# EAGLE schematic CarreraBahn (EAGLE 6.4)
AUTHOR: Florian Weber 44907

## Sheet 1 of 4
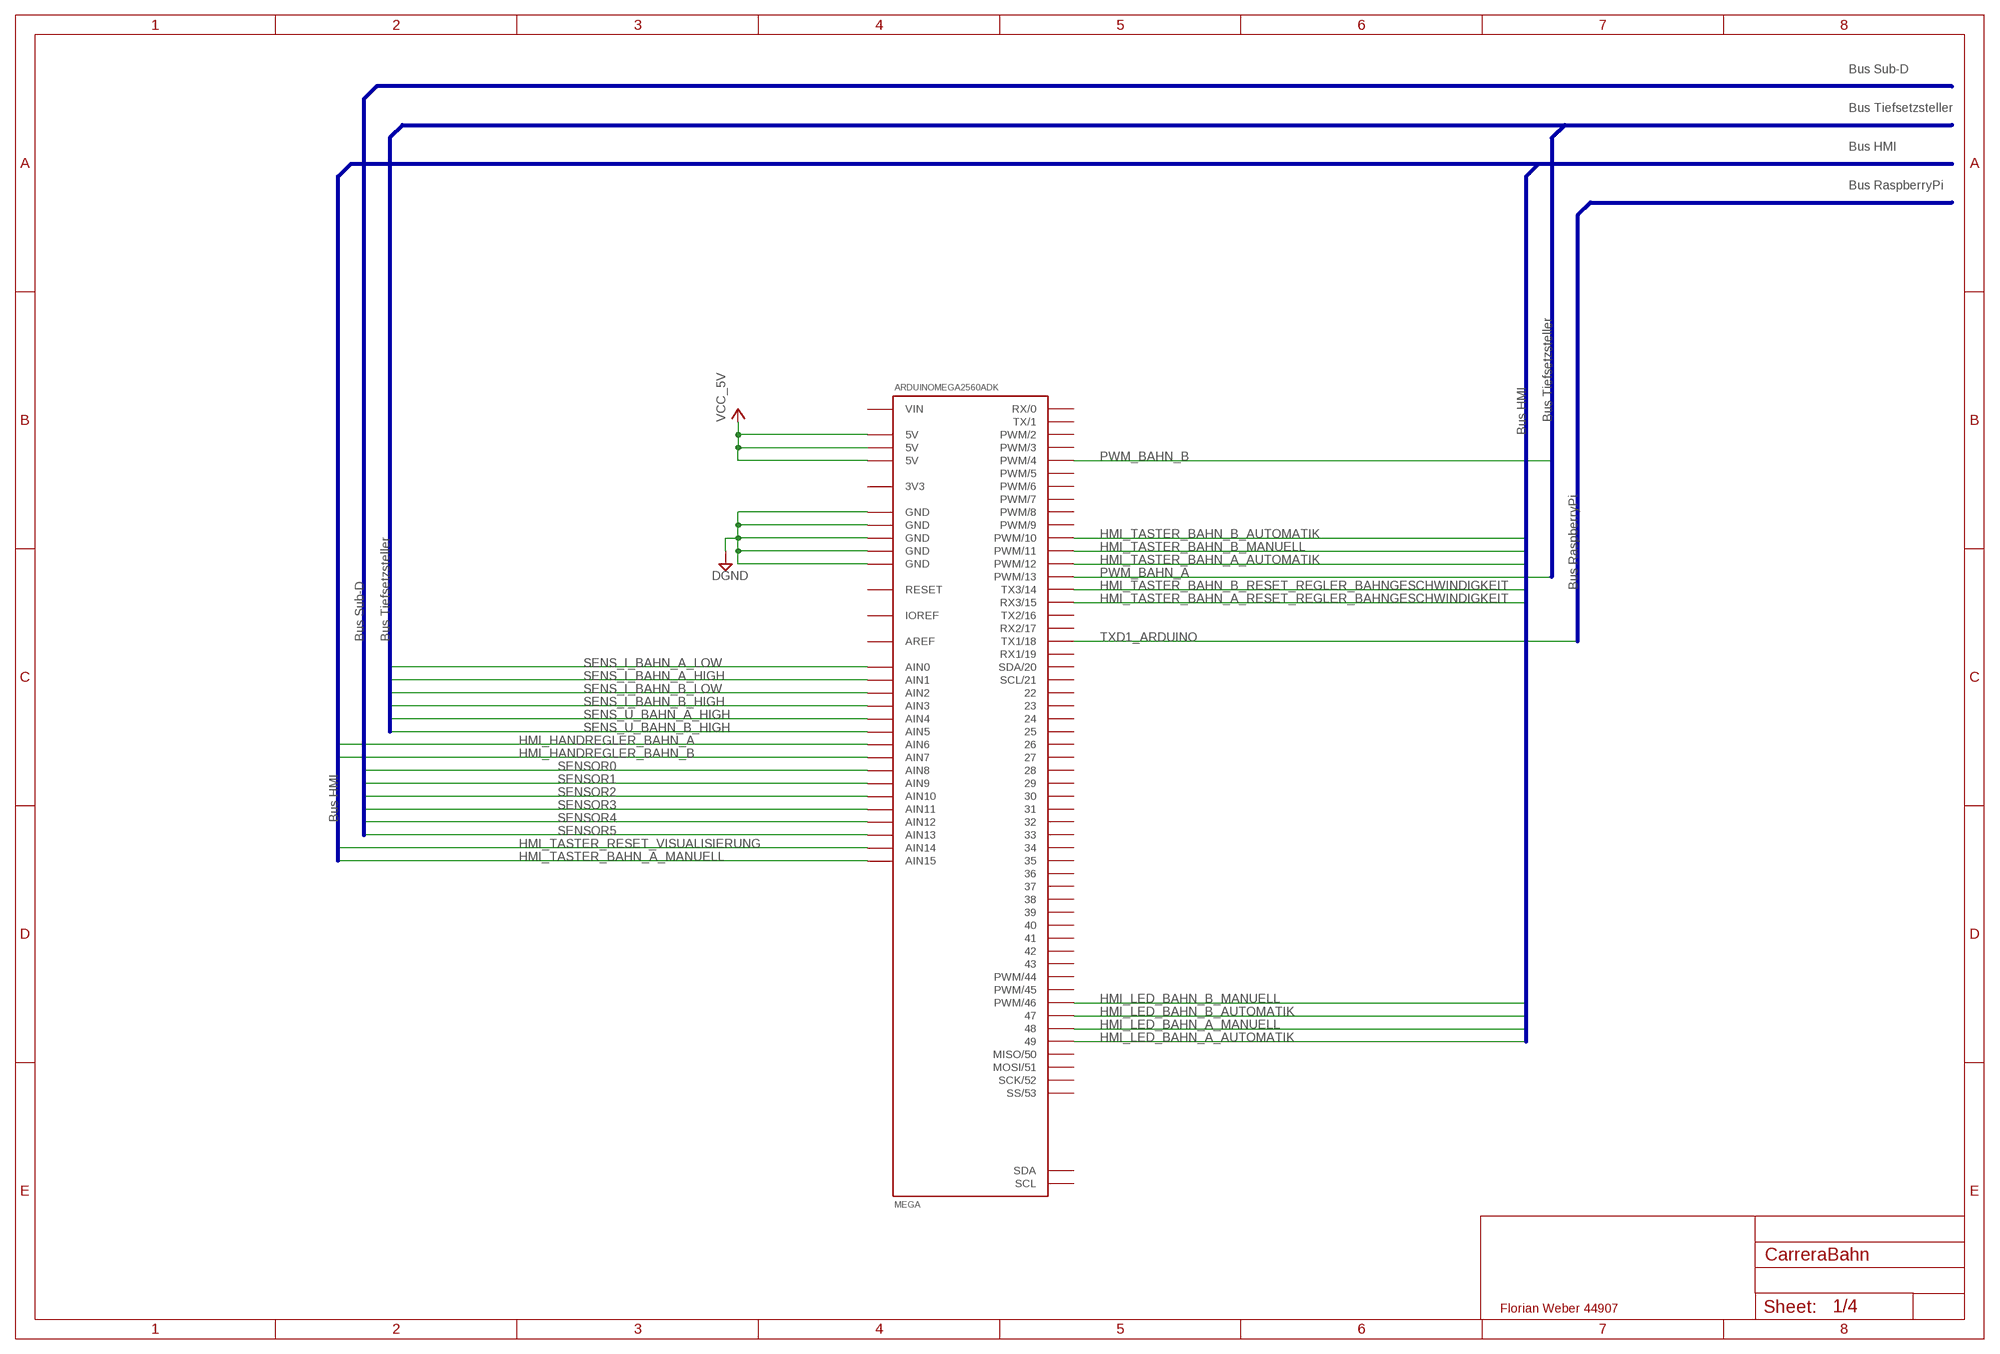
[diagram p0: schematic, sheet 1]

### Parts
ARDUINOMEGA2560ADK  MEGA  [MEGA]

### Nets
DGND: ARDUINOMEGA2560ADK.GND1(GND) ARDUINOMEGA2560ADK.GND2(GND) ARDUINOMEGA2560ADK.GND3(GND) ARDUINOMEGA2560ADK.GND4(GND) ARDUINOMEGA2560ADK.GND5(GND) ; also sheet 2,3,4
HMI_HANDREGLER_BAHN_A: ARDUINOMEGA2560ADK.AIN6 ; also sheet 3
HMI_HANDREGLER_BAHN_B: ARDUINOMEGA2560ADK.AIN7 ; also sheet 3
HMI_LED_BAHN_A_AUTOMATIK: ARDUINOMEGA2560ADK.49 ; also sheet 3
HMI_LED_BAHN_A_MANUELL: ARDUINOMEGA2560ADK.48 ; also sheet 3
HMI_LED_BAHN_B_AUTOMATIK: ARDUINOMEGA2560ADK.47 ; also sheet 3
HMI_LED_BAHN_B_MANUELL: ARDUINOMEGA2560ADK.46(PWM/46) ; also sheet 3
HMI_TASTER_BAHN_A_AUTOMATIK: ARDUINOMEGA2560ADK.12(PWM/12) ; also sheet 3
HMI_TASTER_BAHN_A_MANUELL: ARDUINOMEGA2560ADK.AIN15 ; also sheet 3
HMI_TASTER_BAHN_A_RESET_REGLER_BAHNGESCHWINDIGKEIT: ARDUINOMEGA2560ADK.15(RX3/15) ; also sheet 3
HMI_TASTER_BAHN_B_AUTOMATIK: ARDUINOMEGA2560ADK.10(PWM/10) ; also sheet 3
HMI_TASTER_BAHN_B_MANUELL: ARDUINOMEGA2560ADK.11(PWM/11) ; also sheet 3
HMI_TASTER_BAHN_B_RESET_REGLER_BAHNGESCHWINDIGKEIT: ARDUINOMEGA2560ADK.14(TX3/14) ; also sheet 3
HMI_TASTER_RESET_VISUALISIERUNG: ARDUINOMEGA2560ADK.AIN14 ; also sheet 3
PWM_BAHN_A: ARDUINOMEGA2560ADK.13(PWM/13) ; also sheet 4
PWM_BAHN_B: ARDUINOMEGA2560ADK.4(PWM/4) ; also sheet 4
SENS_I_BAHN_A_HIGH: ARDUINOMEGA2560ADK.AIN1 ; also sheet 4
SENS_I_BAHN_A_LOW: ARDUINOMEGA2560ADK.AIN0 ; also sheet 4
SENS_I_BAHN_B_HIGH: ARDUINOMEGA2560ADK.AIN3 ; also sheet 4
SENS_I_BAHN_B_LOW: ARDUINOMEGA2560ADK.AIN2 ; also sheet 4
SENS_U_BAHN_A_HIGH: ARDUINOMEGA2560ADK.AIN4 ; also sheet 4
SENS_U_BAHN_B_HIGH: ARDUINOMEGA2560ADK.AIN5 ; also sheet 4
SENSOR0: ARDUINOMEGA2560ADK.AIN8 ; also sheet 4
SENSOR1: ARDUINOMEGA2560ADK.AIN9 ; also sheet 4
SENSOR2: ARDUINOMEGA2560ADK.AIN10 ; also sheet 4
SENSOR3: ARDUINOMEGA2560ADK.AIN11 ; also sheet 4
SENSOR4: ARDUINOMEGA2560ADK.AIN12 ; also sheet 4
SENSOR5: ARDUINOMEGA2560ADK.AIN13 ; also sheet 4
TXD1_ARDUINO: ARDUINOMEGA2560ADK.18(TX1/18) ; also sheet 2
VCC: ARDUINOMEGA2560ADK.5V1(5V) ARDUINOMEGA2560ADK.5V2(5V) ARDUINOMEGA2560ADK.5V3(5V) ; supply symbol labelled VCC_5V ; also sheet 2,3,4
Unconnected: ARDUINOMEGA2560ADK.0(RX/0) ARDUINOMEGA2560ADK.1(TX/1) ARDUINOMEGA2560ADK.2(PWM/2) ARDUINOMEGA2560ADK.3(PWM/3) ARDUINOMEGA2560ADK.5(PWM/5) ARDUINOMEGA2560ADK.6(PWM/6) ARDUINOMEGA2560ADK.7(PWM/7) ARDUINOMEGA2560ADK.8(PWM/8) ARDUINOMEGA2560ADK.9(PWM/9) ARDUINOMEGA2560ADK.16(TX2/16) ARDUINOMEGA2560ADK.17(RX2/17) ARDUINOMEGA2560ADK.19(RX1/19) ARDUINOMEGA2560ADK.20(SDA/20) ARDUINOMEGA2560ADK.21(SCL/21) ARDUINOMEGA2560ADK.22 ARDUINOMEGA2560ADK.23 ARDUINOMEGA2560ADK.24 ARDUINOMEGA2560ADK.25 ARDUINOMEGA2560ADK.26 ARDUINOMEGA2560ADK.27 ARDUINOMEGA2560ADK.28 ARDUINOMEGA2560ADK.29 ARDUINOMEGA2560ADK.30 ARDUINOMEGA2560ADK.31 ARDUINOMEGA2560ADK.32 ARDUINOMEGA2560ADK.33 ARDUINOMEGA2560ADK.34 ARDUINOMEGA2560ADK.35 ARDUINOMEGA2560ADK.36 ARDUINOMEGA2560ADK.37 ARDUINOMEGA2560ADK.38 ARDUINOMEGA2560ADK.39 ARDUINOMEGA2560ADK.40 ARDUINOMEGA2560ADK.41 ARDUINOMEGA2560ADK.42 ARDUINOMEGA2560ADK.43 ARDUINOMEGA2560ADK.44(PWM/44) ARDUINOMEGA2560ADK.45(PWM/45) ARDUINOMEGA2560ADK.50(MISO/50) ARDUINOMEGA2560ADK.51(MOSI/51) ARDUINOMEGA2560ADK.52(SCK/52) ARDUINOMEGA2560ADK.53(SS/53) ARDUINOMEGA2560ADK.RST(RESET) ARDUINOMEGA2560ADK.SCL ARDUINOMEGA2560ADK.SDA

### Buses
POWER_BAHN_A_PLUS,POWER_BAHN_A_MINUS,POWER_BAHN_B_PLUS,POWER_BAHN_B_MINUS,SENSOR[0..5]
PWM_BAHN_A,SENS_I_BAHN_A_HIGH,SENS_I_BAHN_A_LOW,SENS_U_BAHN_A_HIGH,PWM_BAHN_B,SENS_I_BAHN_B_HIGH,SENS_I_BAHN_B_LOW,SENS_U_BAHN_B_HIGH,POWER_IN_TIEFSETZSTELLER_BAHN_A_PLUS,POWER_IN_TIEFSETZSTELLER_BAHN_A_MINUS,POWER_IN_TIEFSETZSTELLER_BAHN_B_PLUS,POWER_IN_TIEFSETZSTELLER_BAHN_B_MINUS
HMI_TASTER_BAHN_A_AUTOMATIK,HMI_TASTER_BAHN_A_MANUELL,HMI_TASTER_BAHN_A_RESET_REGLER_BAHNGESCHWINDIGKEIT,HMI_LED_BAHN_A_AUTOMATIK,HMI_LED_BAHN_A_MANUELL,HMI_HANDREGLER_BAHN_A,HMI_TASTER_BAHN_B_AUTOMATIK,HMI_TASTER_BAHN_B_MANUELL,HMI_TASTER_BAHN_B_RESET_REGLER_BAHNGESCHWINDIGKEIT,HMI_LED_BAHN_B_AUTOMATIK,HMI_LED_BAHN_B_MANUELL,HMI_HANDREGLER_BAHN_B,HMI_TASTER_RESET_VISUALISIERUNG
TXD1_ARDUINO

### Notes on the sheet
- Bus Sub-D
- Bus Tiefsetzsteller
- Bus HMI
- Bus RaspberryPi
- Bus Tiefsetzsteller
- Bus HMI
- Bus RaspberryPi
- Bus Sub-D | Bus Tiefsetzsteller
- Bus HMI

## Sheet 2 of 4
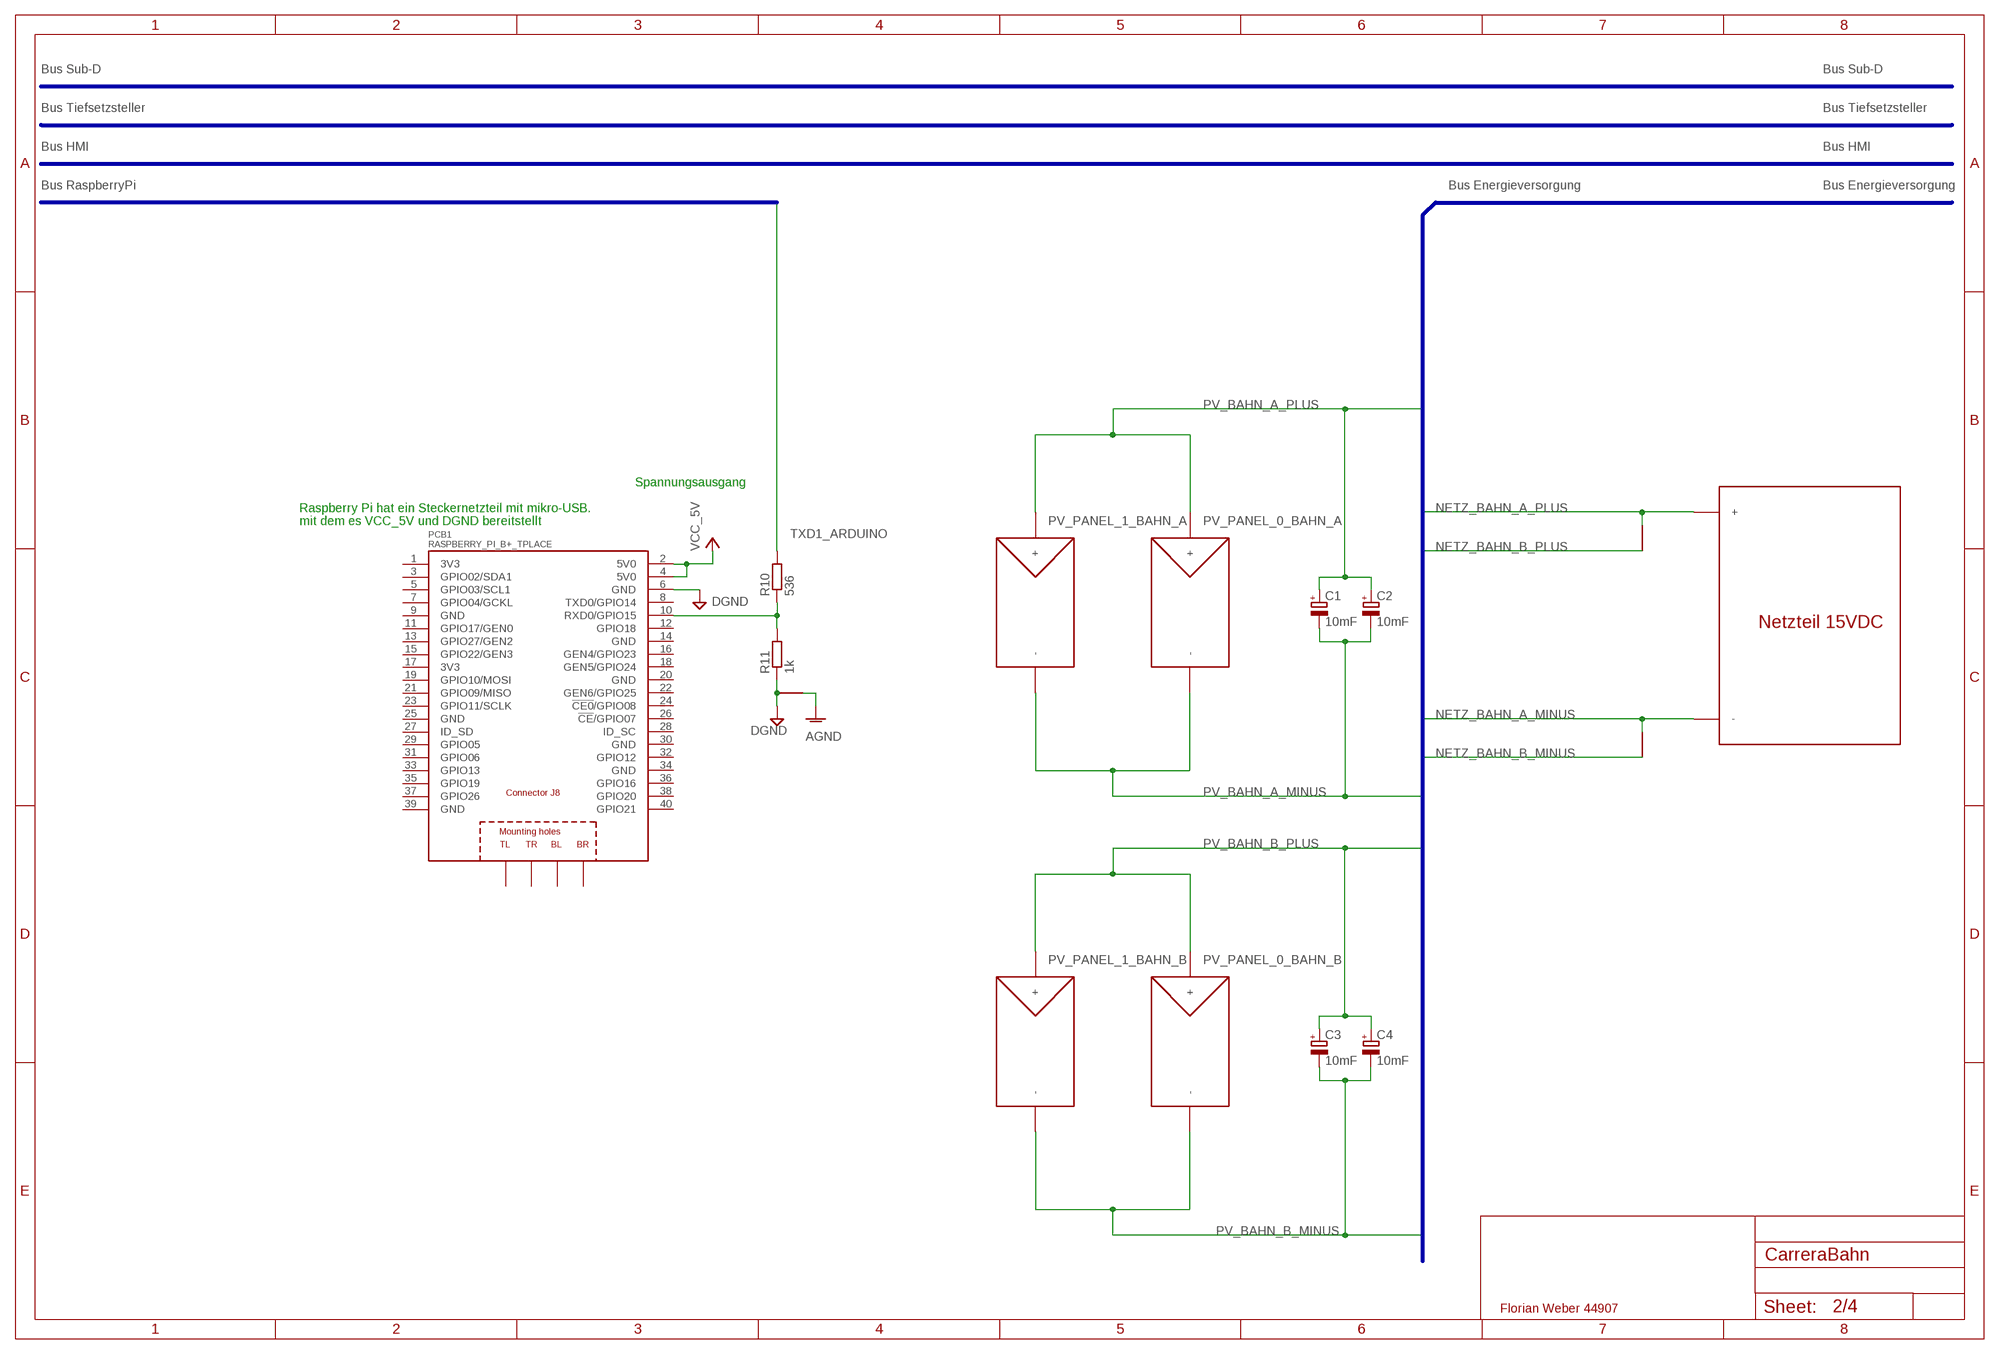
[diagram p1: schematic, sheet 2]

### Parts
C1  10mF  CPOL-EUE10-35  [EB35D]
C2  10mF  CPOL-EUE10-35  [EB35D]
C3  10mF  CPOL-EUE10-35  [EB35D]
C4  10mF  CPOL-EUE10-35  [EB35D]
PCB1  RASPBERRY_PI_B+_TPLACE  [RASPBERRY_PI_BPLUS_TPLACE]
PV_PANEL_0_BAHN_A  PVPANEL  [2PIN]
PV_PANEL_0_BAHN_B  PVPANEL  [2PIN]
PV_PANEL_1_BAHN_A  PVPANEL  [2PIN]
PV_PANEL_1_BAHN_B  PVPANEL  [2PIN]
R10  536  R-EU_0204/5  [0204/5]
R11  1k  R-EU_0204/5  [0204/5]
U$1  NETZTEIL15VDC  [2PIN]
U$3  BRIDGE  [2PIN]
U$4  BRIDGE  [2PIN]
U$5  BRIDGE  [2PIN]

### Nets
AGND: U$5.P0(_) ; also sheet 3,4
DGND: PCB1.6(GND) R11.1 U$5.P1(__) ; also sheet 1,3,4
N$9: PCB1.10(RXD0/GPIO15) R10.1 R11.2
NETZ_BAHN_A_MINUS: U$1.P1(-) U$4.P1(__) ; also sheet 3
NETZ_BAHN_A_PLUS: U$1.P0(+) U$3.P1(__) ; also sheet 3
NETZ_BAHN_B_MINUS: U$4.P0(_) ; also sheet 3
NETZ_BAHN_B_PLUS: U$3.P0(_) ; also sheet 3
PV_BAHN_A_MINUS: C1.- C2.- PV_PANEL_0_BAHN_A.P1(-) PV_PANEL_1_BAHN_A.P1(-) ; also sheet 3
PV_BAHN_A_PLUS: C1.+ C2.+ PV_PANEL_0_BAHN_A.P0(+) PV_PANEL_1_BAHN_A.P0(+) ; also sheet 3
PV_BAHN_B_MINUS: C3.- C4.- PV_PANEL_0_BAHN_B.P1(-) PV_PANEL_1_BAHN_B.P1(-) ; also sheet 3
PV_BAHN_B_PLUS: C3.+ C4.+ PV_PANEL_0_BAHN_B.P0(+) PV_PANEL_1_BAHN_B.P0(+) ; also sheet 3
TXD1_ARDUINO: R10.2 ; also sheet 1
VCC: PCB1.2(5V0) PCB1.4(5V0) ; supply symbol labelled VCC_5V ; also sheet 1,3,4
Unconnected: PCB1.3(GPIO02/SDA1) PCB1.5(GPIO03/SCL1) PCB1.7(GPIO04/GCKL) PCB1.8(TXD0/GPIO14) PCB1.11(GPIO17/GEN0) PCB1.12(GPIO18) PCB1.13(GPIO27/GEN2) PCB1.15(GPIO22/GEN3) PCB1.16(GEN4/GPIO23) PCB1.18(GEN5/GPIO24) PCB1.19(GPIO10/MOSI) PCB1.21(GPIO09/MISO) PCB1.22(GEN6/GPIO25) PCB1.23(GPIO11/SCLK) PCB1.24(!CE0!/GPIO08) PCB1.26(!CE!/GPIO07) PCB1.27(ID_SD) PCB1.28(ID_SC) PCB1.29(GPIO05) PCB1.31(GPIO06) PCB1.32(GPIO12) PCB1.33(GPIO13) PCB1.35(GPIO19) PCB1.36(GPIO16) PCB1.37(GPIO26) PCB1.38(GPIO20) PCB1.40(GPIO21) PCB1.PE_BL(BL) PCB1.PE_BR(BR) PCB1.PE_TL(TL) PCB1.PE_TR(TR)

### Buses
POWER_BAHN_A_PLUS,POWER_BAHN_A_MINUS,POWER_BAHN_B_PLUS,POWER_BAHN_B_MINUS,SENSOR[0..5]
PV_BAHN_A_PLUS,PV_BAHN_A_MINUS,NETZ_BAHN_A_PLUS,NETZ_BAHN_A_MINUS,PV_BAHN_B_PLUS,PV_BAHN_B_MINUS,NETZ_BAHN_B_PLUS,NETZ_BAHN_B_MINUS
HMI_TASTER_BAHN_A_AUTOMATIK,HMI_TASTER_BAHN_A_MANUELL,HMI_TASTER_BAHN_A_RESET_REGLER_BAHNGESCHWINDIGKEIT,HMI_LED_BAHN_A_AUTOMATIK,HMI_LED_BAHN_A_MANUELL,HMI_HANDREGLER_BAHN_A,HMI_TASTER_BAHN_B_AUTOMATIK,HMI_TASTER_BAHN_B_MANUELL,HMI_TASTER_BAHN_B_RESET_REGLER_BAHNGESCHWINDIGKEIT,HMI_LED_BAHN_B_AUTOMATIK,HMI_LED_BAHN_B_MANUELL,HMI_HANDREGLER_BAHN_B,HMI_TASTER_RESET_VISUALISIERUNG
PWM_BAHN_A,SENS_I_BAHN_A_HIGH,SENS_I_BAHN_A_LOW,SENS_U_BAHN_A_HIGH,PWM_BAHN_B,SENS_I_BAHN_B_HIGH,SENS_I_BAHN_B_LOW,SENS_U_BAHN_B_HIGH,POWER_IN_TIEFSETZSTELLER_BAHN_A_PLUS,POWER_IN_TIEFSETZSTELLER_BAHN_A_MINUS,POWER_IN_TIEFSETZSTELLER_BAHN_B_PLUS,POWER_IN_TIEFSETZSTELLER_BAHN_B_MINUS
TXD1_ARDUINO

### Notes on the sheet
- Bus Sub-D | Bus Sub-D
- Bus Tiefsetzsteller | Bus Tiefsetzsteller
- Bus HMI | Bus HMI
- Bus RaspberryPi | Bus Energieversorgung | Bus Energieversorgung
- Spannungsausgang
- Raspberry Pi hat ein Steckernetzteil mit mikro-USB.
- mit dem es VCC_5V und DGND bereitstellt

## Sheet 3 of 4
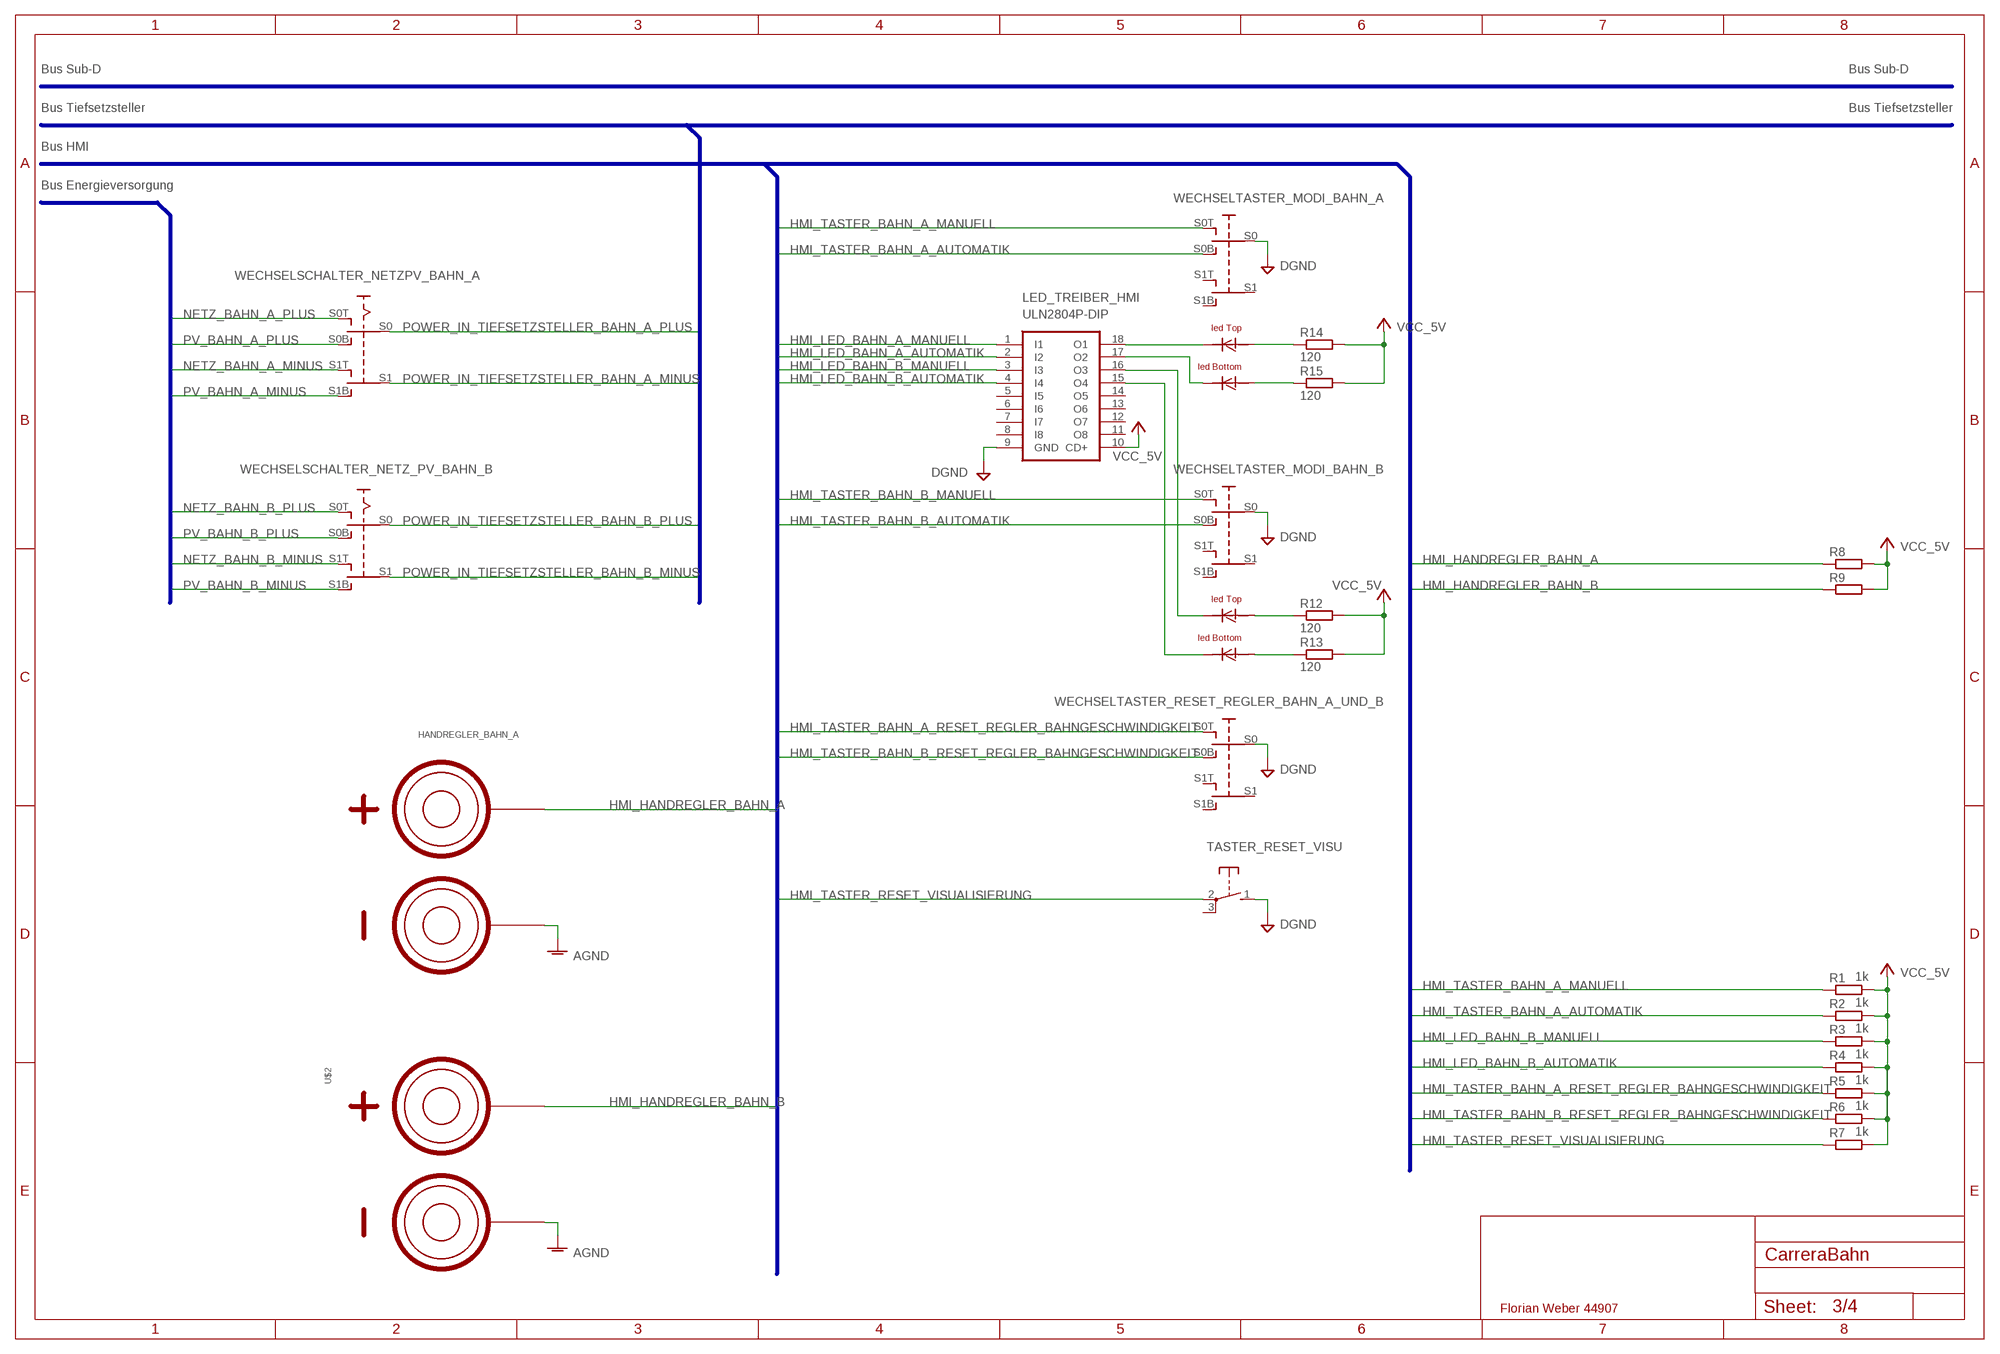
[diagram p2: schematic, sheet 3]

### Parts
HANDREGLER_BAHN_A  LABORBUCHSE2  [2PIN]
LED_TREIBER_HMI  ULN2804P-DIP  [DIL18]
R1  1k  R-EU_0204/2V  [0204V]
R2  1k  R-EU_0204/2V  [0204V]
R3  1k  R-EU_0204/2V  [0204V]
R4  1k  R-EU_0204/2V  [0204V]
R5  1k  R-EU_0204/2V  [0204V]
R6  1k  R-EU_0204/2V  [0204V]
R7  1k  R-EU_0204/2V  [0204V]
R8  R-EU_0204/2V  [0204V]
R9  R-EU_0204/2V  [0204V]
R12  120  R-EU_0204/2V  [0204V]
R13  120  R-EU_0204/2V  [0204V]
R14  120  R-EU_0204/2V  [0204V]
R15  120  R-EU_0204/2V  [0204V]
TASTER_RESET_VISU  RF15  [RF15]
U$2  LABORBUCHSE2  [2PIN]
WECHSELSCHALTER_NETZ_PV_BAHN_B  SWITCH2TOGGLE  [SWITCH2]
WECHSELSCHALTER_NETZPV_BAHN_A  SWITCH2TOGGLE  [SWITCH2]
WECHSELTASTER_MODI_BAHN_A  SWITCH2LED  [SWITCH2LED]
WECHSELTASTER_MODI_BAHN_B  SWITCH2LED  [SWITCH2LED]
WECHSELTASTER_RESET_REGLER_BAHN_A_UND_B  SWITCH2  [SWITCH2]

### Nets
AGND: HANDREGLER_BAHN_A.P0(MINUS) U$2.P0(MINUS) ; also sheet 2,4
DGND: LED_TREIBER_HMI.9(GND) TASTER_RESET_VISU.1(S) WECHSELTASTER_MODI_BAHN_A.S0 WECHSELTASTER_MODI_BAHN_B.S0 WECHSELTASTER_RESET_REGLER_BAHN_A_UND_B.S0 ; also sheet 1,2,4
HMI_HANDREGLER_BAHN_A: HANDREGLER_BAHN_A.P1(PLUS) R8.1 ; also sheet 1
HMI_HANDREGLER_BAHN_B: R9.1 U$2.P1(PLUS) ; also sheet 1
HMI_LED_BAHN_A_AUTOMATIK: LED_TREIBER_HMI.2(I2) ; also sheet 1
HMI_LED_BAHN_A_MANUELL: LED_TREIBER_HMI.1(I1) ; also sheet 1
HMI_LED_BAHN_B_AUTOMATIK: LED_TREIBER_HMI.4(I4) R4.1 ; also sheet 1
HMI_LED_BAHN_B_MANUELL: LED_TREIBER_HMI.3(I3) R3.1 ; also sheet 1
HMI_TASTER_BAHN_A_AUTOMATIK: R2.1 WECHSELTASTER_MODI_BAHN_A.S0B ; also sheet 1
HMI_TASTER_BAHN_A_MANUELL: R1.1 WECHSELTASTER_MODI_BAHN_A.S0T ; also sheet 1
HMI_TASTER_BAHN_A_RESET_REGLER_BAHNGESCHWINDIGKEIT: R5.1 WECHSELTASTER_RESET_REGLER_BAHN_A_UND_B.S0T ; also sheet 1
HMI_TASTER_BAHN_B_AUTOMATIK: WECHSELTASTER_MODI_BAHN_B.S0B ; also sheet 1
HMI_TASTER_BAHN_B_MANUELL: WECHSELTASTER_MODI_BAHN_B.S0T ; also sheet 1
HMI_TASTER_BAHN_B_RESET_REGLER_BAHNGESCHWINDIGKEIT: R6.1 WECHSELTASTER_RESET_REGLER_BAHN_A_UND_B.S0B ; also sheet 1
HMI_TASTER_RESET_VISUALISIERUNG: R7.1 TASTER_RESET_VISU.2(P) ; also sheet 1
N$2: LED_TREIBER_HMI.18(O1) WECHSELTASTER_MODI_BAHN_A.LED_TOP_C(C_TOP)
N$3: LED_TREIBER_HMI.17(O2) WECHSELTASTER_MODI_BAHN_A.LED_BOT_C(C_BOT)
N$4: LED_TREIBER_HMI.16(O3) WECHSELTASTER_MODI_BAHN_B.LED_TOP_C(C_TOP)
N$5: LED_TREIBER_HMI.15(O4) WECHSELTASTER_MODI_BAHN_B.LED_BOT_C(C_BOT)
N$7: R14.1 WECHSELTASTER_MODI_BAHN_A.LED_TOP_A(A_TOP)
N$8: R15.1 WECHSELTASTER_MODI_BAHN_A.LED_BOT_A(A_BOT)
N$10: R13.1 WECHSELTASTER_MODI_BAHN_B.LED_BOT_A(A_BOT)
N$11: R12.1 WECHSELTASTER_MODI_BAHN_B.LED_TOP_A(A_TOP)
NETZ_BAHN_A_MINUS: WECHSELSCHALTER_NETZPV_BAHN_A.S1T ; also sheet 2
NETZ_BAHN_A_PLUS: WECHSELSCHALTER_NETZPV_BAHN_A.S0T ; also sheet 2
NETZ_BAHN_B_MINUS: WECHSELSCHALTER_NETZ_PV_BAHN_B.S1T ; also sheet 2
NETZ_BAHN_B_PLUS: WECHSELSCHALTER_NETZ_PV_BAHN_B.S0T ; also sheet 2
POWER_IN_TIEFSETZSTELLER_BAHN_A_MINUS: WECHSELSCHALTER_NETZPV_BAHN_A.S1 ; also sheet 4
POWER_IN_TIEFSETZSTELLER_BAHN_A_PLUS: WECHSELSCHALTER_NETZPV_BAHN_A.S0 ; also sheet 4
POWER_IN_TIEFSETZSTELLER_BAHN_B_MINUS: WECHSELSCHALTER_NETZ_PV_BAHN_B.S1 ; also sheet 4
POWER_IN_TIEFSETZSTELLER_BAHN_B_PLUS: WECHSELSCHALTER_NETZ_PV_BAHN_B.S0 ; also sheet 4
PV_BAHN_A_MINUS: WECHSELSCHALTER_NETZPV_BAHN_A.S1B ; also sheet 2
PV_BAHN_A_PLUS: WECHSELSCHALTER_NETZPV_BAHN_A.S0B ; also sheet 2
PV_BAHN_B_MINUS: WECHSELSCHALTER_NETZ_PV_BAHN_B.S1B ; also sheet 2
PV_BAHN_B_PLUS: WECHSELSCHALTER_NETZ_PV_BAHN_B.S0B ; also sheet 2
VCC: LED_TREIBER_HMI.10(CD+) R1.2 R2.2 R3.2 R4.2 R5.2 R6.2 R7.2 R8.2 R9.2 R12.2 R13.2 R14.2 R15.2 ; supply symbol labelled VCC_5V ; also sheet 1,2,4
Unconnected: LED_TREIBER_HMI.5(I5) LED_TREIBER_HMI.6(I6) LED_TREIBER_HMI.7(I7) LED_TREIBER_HMI.8(I8) LED_TREIBER_HMI.11(O8) LED_TREIBER_HMI.12(O7) LED_TREIBER_HMI.13(O6) LED_TREIBER_HMI.14(O5) TASTER_RESET_VISU.3(P) WECHSELTASTER_MODI_BAHN_A.S1 WECHSELTASTER_MODI_BAHN_A.S1B WECHSELTASTER_MODI_BAHN_A.S1T WECHSELTASTER_MODI_BAHN_B.S1 WECHSELTASTER_MODI_BAHN_B.S1B WECHSELTASTER_MODI_BAHN_B.S1T WECHSELTASTER_RESET_REGLER_BAHN_A_UND_B.S1 WECHSELTASTER_RESET_REGLER_BAHN_A_UND_B.S1B WECHSELTASTER_RESET_REGLER_BAHN_A_UND_B.S1T

### Buses
PWM_BAHN_A,SENS_I_BAHN_A_HIGH,SENS_I_BAHN_A_LOW,SENS_U_BAHN_A_HIGH,PWM_BAHN_B,SENS_I_BAHN_B_HIGH,SENS_I_BAHN_B_LOW,SENS_U_BAHN_B_HIGH,POWER_IN_TIEFSETZSTELLER_BAHN_A_PLUS,POWER_IN_TIEFSETZSTELLER_BAHN_A_MINUS,POWER_IN_TIEFSETZSTELLER_BAHN_B_PLUS,POWER_IN_TIEFSETZSTELLER_BAHN_B_MINUS
POWER_BAHN_A_PLUS,POWER_BAHN_A_MINUS,POWER_BAHN_B_PLUS,POWER_BAHN_B_MINUS,SENSOR[0..5]
HMI_TASTER_BAHN_A_AUTOMATIK,HMI_TASTER_BAHN_A_MANUELL,HMI_TASTER_BAHN_A_RESET_REGLER_BAHNGESCHWINDIGKEIT,HMI_LED_BAHN_A_AUTOMATIK,HMI_LED_BAHN_A_MANUELL,HMI_HANDREGLER_BAHN_A,HMI_TASTER_BAHN_B_AUTOMATIK,HMI_TASTER_BAHN_B_MANUELL,HMI_TASTER_BAHN_B_RESET_REGLER_BAHNGESCHWINDIGKEIT,HMI_LED_BAHN_B_AUTOMATIK,HMI_LED_BAHN_B_MANUELL,HMI_HANDREGLER_BAHN_B,HMI_TASTER_RESET_VISUALISIERUNG
PV_BAHN_A_PLUS,PV_BAHN_A_MINUS,NETZ_BAHN_A_PLUS,NETZ_BAHN_A_MINUS,PV_BAHN_B_PLUS,PV_BAHN_B_MINUS,NETZ_BAHN_B_PLUS,NETZ_BAHN_B_MINUS

### Notes on the sheet
- Bus Sub-D | Bus Sub-D
- Bus Tiefsetzsteller | Bus Tiefsetzsteller
- Bus HMI
- Bus Energieversorgung

## Sheet 4 of 4
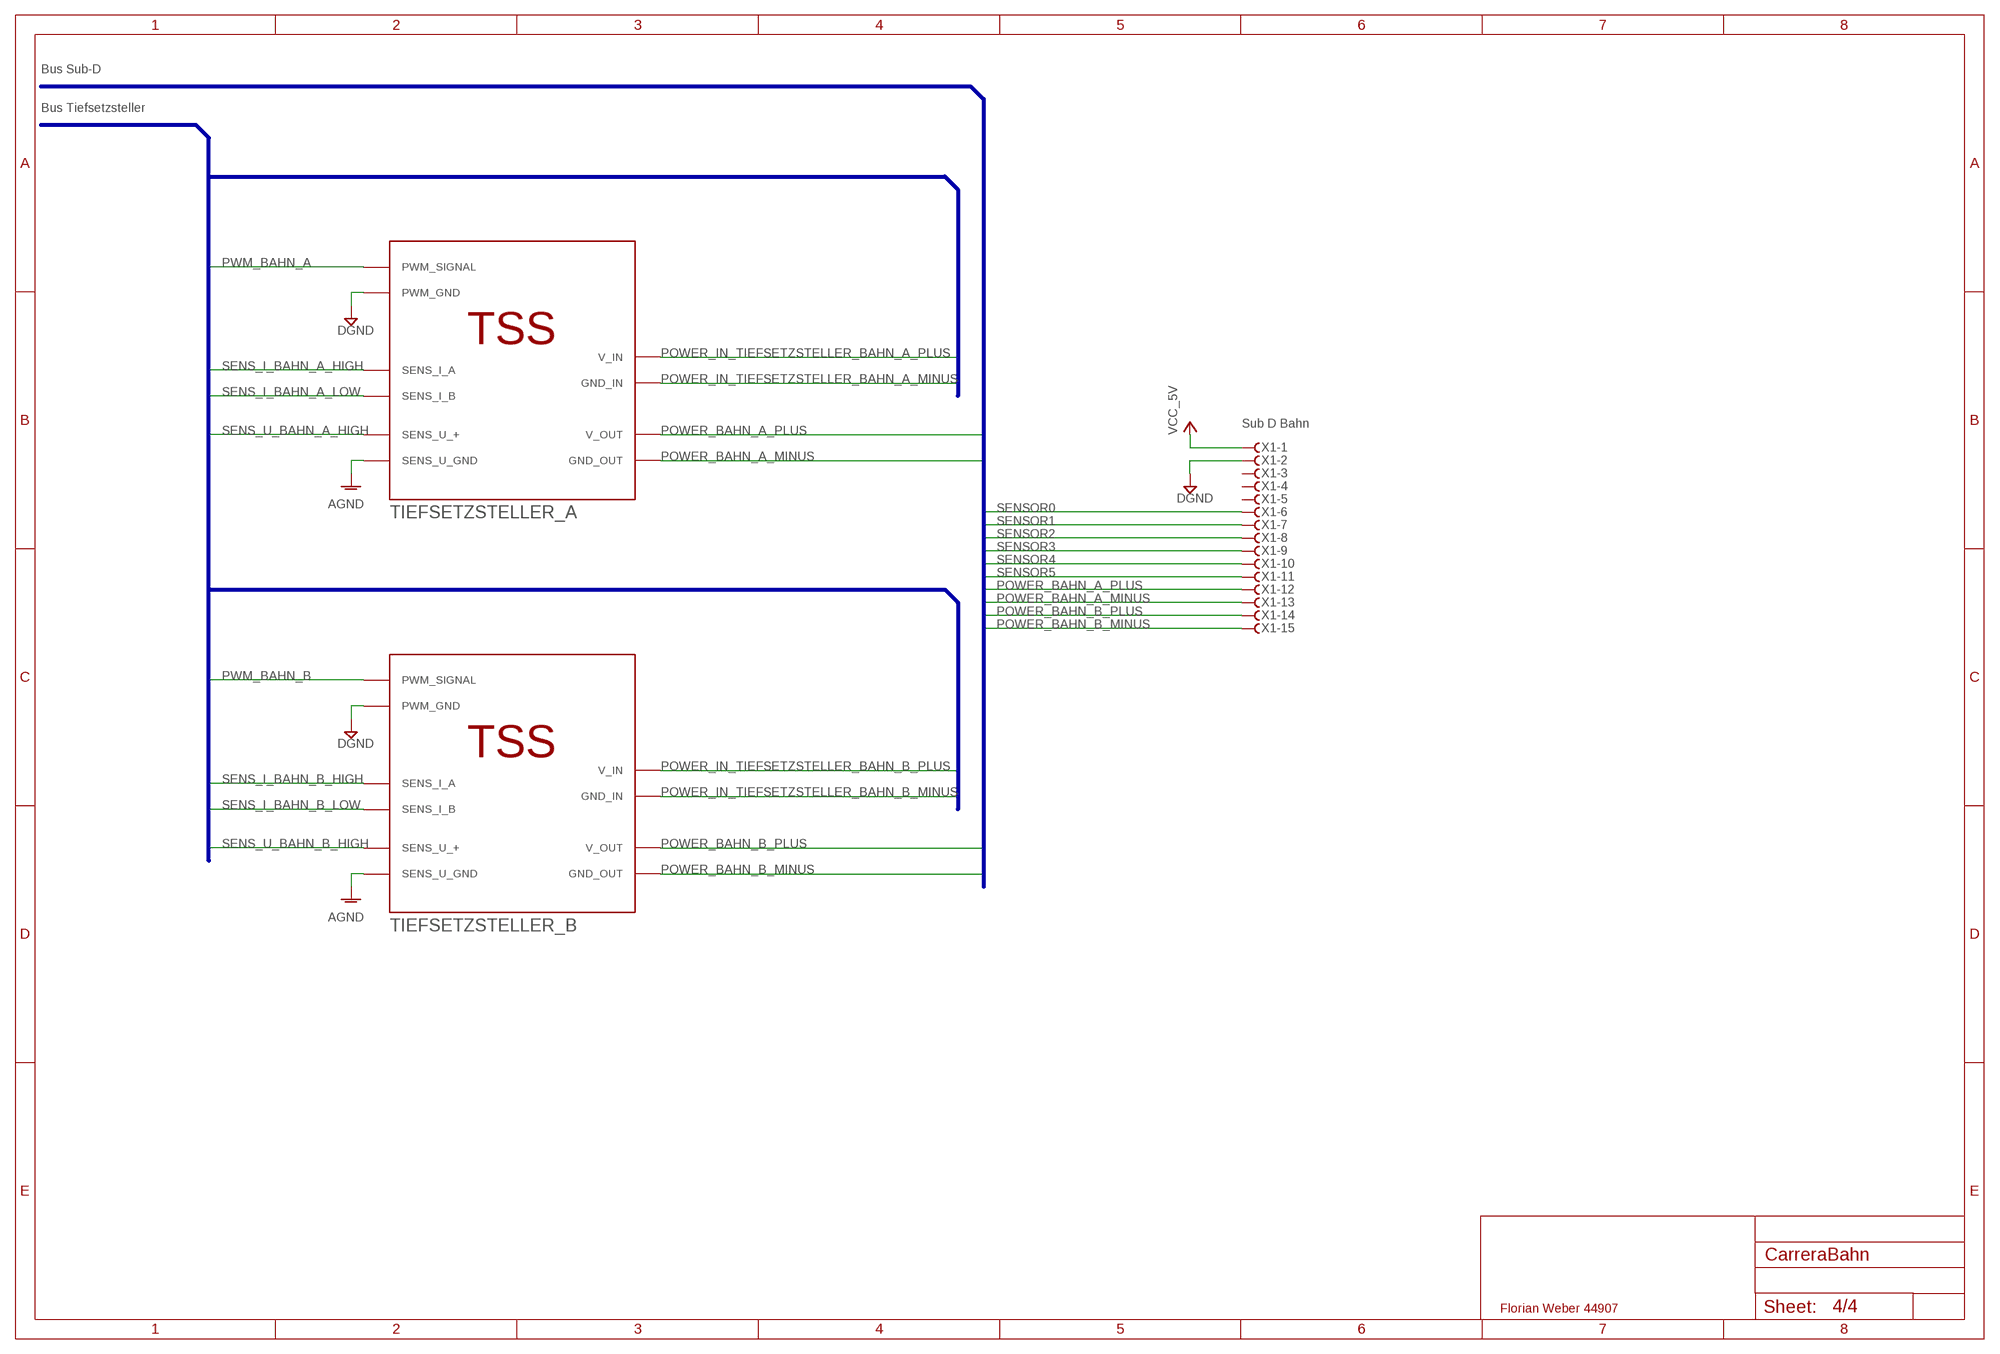
[diagram p3: schematic, sheet 4]

### Parts
TIEFSETZSTELLER_A  TSS  [TSS]
TIEFSETZSTELLER_B  TSS  [TSS]
X1  Sub D Bahn  F15HDVS  [HDF15V]

### Nets
AGND: TIEFSETZSTELLER_A.7(SENS_U_GND) TIEFSETZSTELLER_B.7(SENS_U_GND) ; also sheet 2,3
DGND: TIEFSETZSTELLER_A.8(PWM_GND) TIEFSETZSTELLER_B.8(PWM_GND) X1.2 ; also sheet 1,2,3
POWER_BAHN_A_MINUS: TIEFSETZSTELLER_A.2(GND_OUT) X1.13
POWER_BAHN_A_PLUS: TIEFSETZSTELLER_A.0(V_OUT) X1.12
POWER_BAHN_B_MINUS: TIEFSETZSTELLER_B.2(GND_OUT) X1.15
POWER_BAHN_B_PLUS: TIEFSETZSTELLER_B.0(V_OUT) X1.14
POWER_IN_TIEFSETZSTELLER_BAHN_A_MINUS: TIEFSETZSTELLER_A.5(GND_IN) ; also sheet 3
POWER_IN_TIEFSETZSTELLER_BAHN_A_PLUS: TIEFSETZSTELLER_A.1(V_IN) ; also sheet 3
POWER_IN_TIEFSETZSTELLER_BAHN_B_MINUS: TIEFSETZSTELLER_B.5(GND_IN) ; also sheet 3
POWER_IN_TIEFSETZSTELLER_BAHN_B_PLUS: TIEFSETZSTELLER_B.1(V_IN) ; also sheet 3
PWM_BAHN_A: TIEFSETZSTELLER_A.9(PWM_SIGNAL) ; also sheet 1
PWM_BAHN_B: TIEFSETZSTELLER_B.9(PWM_SIGNAL) ; also sheet 1
SENS_I_BAHN_A_HIGH: TIEFSETZSTELLER_A.3(SENS_I_A) ; also sheet 1
SENS_I_BAHN_A_LOW: TIEFSETZSTELLER_A.4(SENS_I_B) ; also sheet 1
SENS_I_BAHN_B_HIGH: TIEFSETZSTELLER_B.3(SENS_I_A) ; also sheet 1
SENS_I_BAHN_B_LOW: TIEFSETZSTELLER_B.4(SENS_I_B) ; also sheet 1
SENS_U_BAHN_A_HIGH: TIEFSETZSTELLER_A.6(SENS_U_+) ; also sheet 1
SENS_U_BAHN_B_HIGH: TIEFSETZSTELLER_B.6(SENS_U_+) ; also sheet 1
SENSOR0: X1.6 ; also sheet 1
SENSOR1: X1.7 ; also sheet 1
SENSOR2: X1.8 ; also sheet 1
SENSOR3: X1.9 ; also sheet 1
SENSOR4: X1.10 ; also sheet 1
SENSOR5: X1.11 ; also sheet 1
VCC: X1.1 ; supply symbol labelled VCC_5V ; also sheet 1,2,3
Unconnected: X1.3 X1.4 X1.5

### Buses
PWM_BAHN_A,SENS_I_BAHN_A_HIGH,SENS_I_BAHN_A_LOW,SENS_U_BAHN_A_HIGH,PWM_BAHN_B,SENS_I_BAHN_B_HIGH,SENS_I_BAHN_B_LOW,SENS_U_BAHN_B_HIGH,POWER_IN_TIEFSETZSTELLER_BAHN_A_PLUS,POWER_IN_TIEFSETZSTELLER_BAHN_A_MINUS,POWER_IN_TIEFSETZSTELLER_BAHN_B_PLUS,POWER_IN_TIEFSETZSTELLER_BAHN_B_MINUS
POWER_BAHN_A_PLUS,POWER_BAHN_A_MINUS,POWER_BAHN_B_PLUS,POWER_BAHN_B_MINUS,SENSOR[0..5]

### Notes on the sheet
- Bus Sub-D
- Bus Tiefsetzsteller

## Power pins joined to a net without a drawn wire
3V3: ARDUINOMEGA2560ADK.3V3 PCB1.1(3V3) PCB1.17(3V3)
AREF: ARDUINOMEGA2560ADK.AREF
GND: PCB1.9(GND) PCB1.14(GND) PCB1.20(GND) PCB1.25(GND) PCB1.30(GND) PCB1.34(GND) PCB1.39(GND)
IOREF: ARDUINOMEGA2560ADK.IOREF
VIN: ARDUINOMEGA2560ADK.VIN

## Library data of the parts
ARDUINOMEGA2560ADK = welectronic:MEGA: Arduino MEGA
C1-C4 = rcl:CPOL-EU: POLARIZED CAPACITOR, European symbol
HANDREGLER_BAHN_A U$2 = carrera:LABORBUCHSE2
LED_TREIBER_HMI = 11_my_stuff:ULN2804
PCB1 = RASPBERRY_PI_Bplus-eagle5:RASPBERRY_PI_B+: Raspberry Pi B+ Basedon issue: Thursday, July 10, 2014 - Rev 1.2 LBR by Tim Rettmann 07-2014
PV_PANEL_0_BAHN_A PV_PANEL_0_BAHN_B PV_PANEL_1_BAHN_A PV_PANEL_1_BAHN_B = carrera:PVPANEL
R1-R15 = rcl:R-EU_: RESISTOR, European symbol
TASTER_RESET_VISU = switch-misc:RF15: RAFI SWITCH
TIEFSETZSTELLER_A TIEFSETZSTELLER_B = carrera:TSS
U$1 = carrera:NETZTEIL15VDC
U$3-U$5 = carrera:BRIDGE
WECHSELSCHALTER_NETZ_PV_BAHN_B WECHSELSCHALTER_NETZPV_BAHN_A = carrera:SWITCH2TOGGLE
WECHSELTASTER_MODI_BAHN_A WECHSELTASTER_MODI_BAHN_B = carrera:SWITCH2LED
WECHSELTASTER_RESET_REGLER_BAHN_A_UND_B = carrera:SWITCH2
X1 = con-subd:F15?S: SUB-D; OC_FARNELL: unknown; OC_NEWARK: unknown